# EAGLE design ucmp (EAGLE 9.5.2)
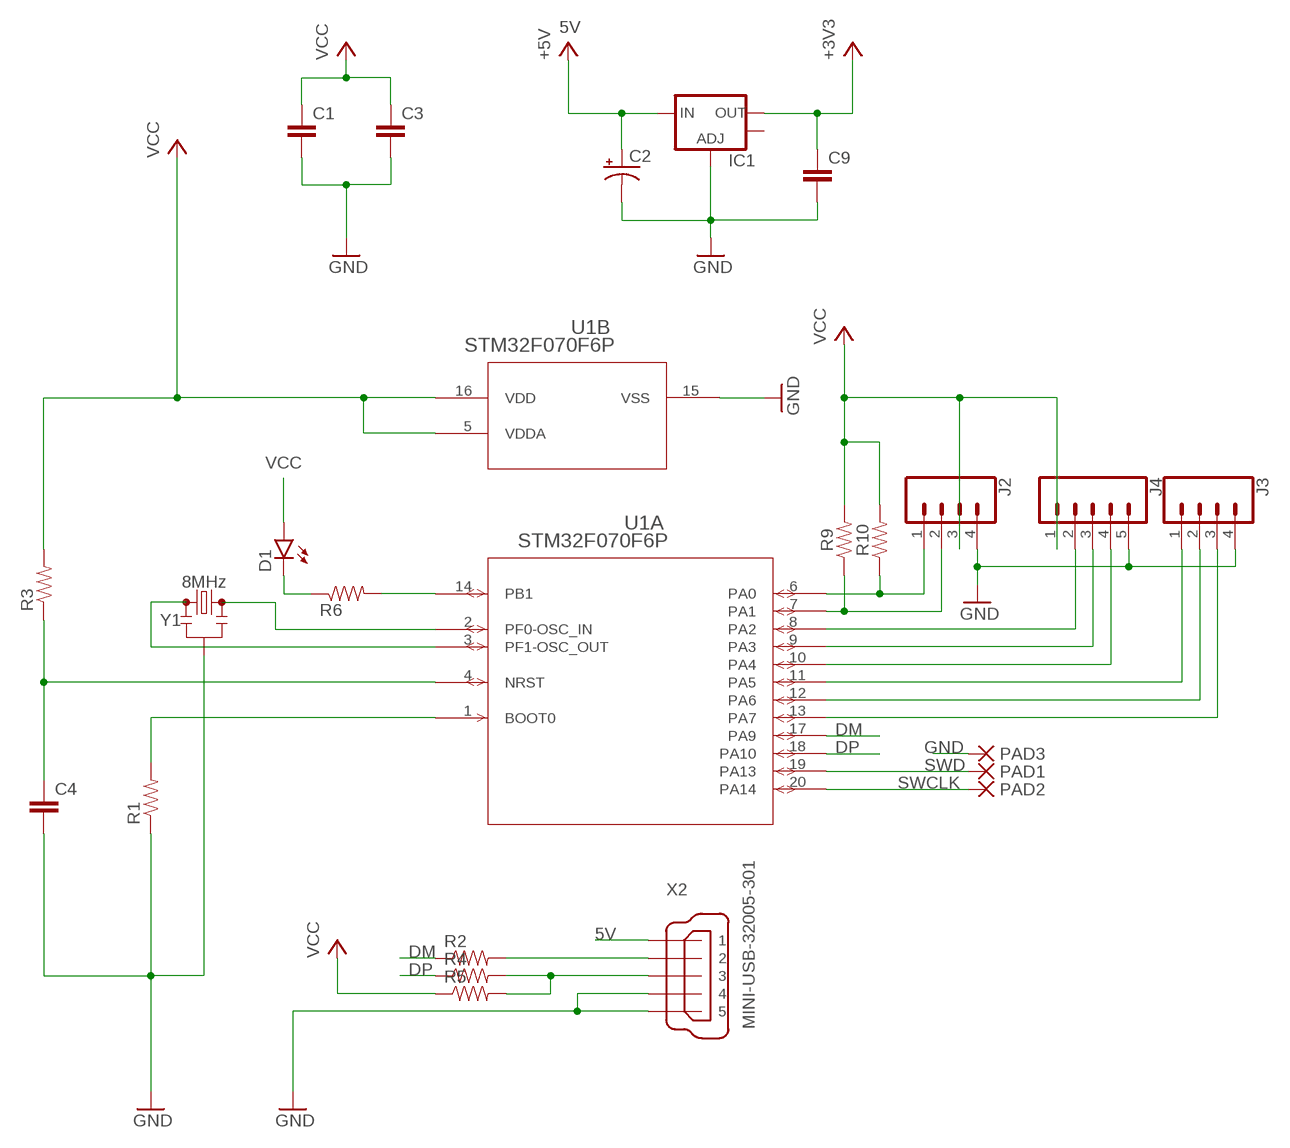
[diagram p0: schematic, sheet 1]

## Parts
C1  CAP0805  [0805]
C2  CAP_POL3528-KIT  [EIA3528-KIT]
C3  CAP0805  [0805]
C4  CAP0805  [0805]
C9  CAP1206  [1206]
D1  LED0603  [LED-0603]
IC1  V_REG_LM1117SOT223  [SOT223]
J2  CONN_041.27MM  [1X04_1.27MM]
J3  CONN_041.27MM  [1X04_1.27MM]
J4  CONN_051.27MM  [1X05_1.27MM]
PAD1  PAD-SMD07R  [SMD07R]
PAD2  PAD-SMD07R  [SMD07R]
PAD3  PAD-SMD07R  [SMD07R]
R1  4.7OHM-1/10W-5%(0603)  [0603-RES]
R2  4.7OHM-1/10W-5%(0603)  [0603-RES]
R3  4.7OHM-1/10W-5%(0603)  [0603-RES]
R4  4.7OHM-1/10W-5%(0603)  [0603-RES]
R5  4.7OHM-1/10W-5%(0603)  [0603-RES]
R6  4.7OHM-1/10W-5%(0603)  [0603-RES]
R9  RESISTOR0805  [0805]
R10  RESISTOR0805  [0805]
U1  STM32F070F6P  [TSSOP20]
X2  MINI-USB-32005-301  [32005-301]
Y1  8MHz  RESONATOR-8MHZSMD_3.2X1.3  [RESONATOR-SMD-3.2X1.3]

## Nets
5V: C2.A(+) IC1.3(IN) X2.1 ; supply symbol labelled +5V
DM: R2.1 U1.17(A:PA9)
DP: R4.1 U1.18(A:PA10)
GND: C1.2 C2.C(-) C3.2 C4.2 C9.2 IC1.1(ADJ) J2.4 J3.4 J4.5 PAD3.PAD(P) R1.1 U1.15(B:VSS) X2.4 X2.5 Y1.2
N$1: R1.2 U1.1(A:BOOT0)
N$2: C4.1 R3.1 U1.4(A:NRST)
N$3: R6.2 U1.14(A:PB1)
N$4: D1.C R6.1
N$5: J2.1 R10.1 U1.6(A:PA0)
N$6: J2.2 R9.1 U1.7(A:PA1)
N$7: J4.2 U1.8(A:PA2)
N$8: J4.3 U1.9(A:PA3)
N$9: J4.4 U1.10(A:PA4)
N$10: R2.2 X2.2
N$11: J3.1 U1.11(A:PA5)
N$12: R4.2 R5.2 X2.3
N$13: J3.2 U1.12(A:PA6)
N$14: J3.3 U1.13(A:PA7)
N$15: U1.2(A:PF0-OSC_IN) Y1.3
N$16: U1.3(A:PF1-OSC_OUT) Y1.1
SWCLK: PAD2.PAD(P) U1.20(A:PA14)
SWD: PAD1.PAD(P) U1.19(A:PA13)
VCC: C1.1 C3.1 C9.1 D1.A IC1.2(OUT) J2.3 J4.1 R3.2 R5.1 R9.2 R10.2 U1.5(B:VDDA) U1.16(B:VDD) ; supply symbol labelled +3V3
Unconnected: IC1.4(OUT)

## Library data of the parts
C1 C3 C4 C9 = SparkFun-Capacitors:CAP: Capacitor Standard 0603 ceramic capacitor, and 0.1" leaded capacitor.
C2 = SparkFun-Passives:CAP_POL: Capacitor Polarized These are standard SMD and PTH capacitors. Normally 10uF, 47uF, and 100uF in electrolytic and tantalum varieties. Always verify the external diameter of the through hole cap, it varies with capacity, voltage, and manufacturer. The EIA devices should be standard.
D1 = SparkFun-LED:LED: LEDs Standard schematic elements and footprints for 5mm, 3mm, 1206, and 0603 sized LEDs. 5mm - Spark Fun Electronics SKU : COM-00529 (and others)
IC1 = SparkFun:V_REG_LM1117: Voltage Regulator LM1117 Standard adjustable voltage regulator but in SMD form. Spark Fun Electronics SKU : COM-00595
J2 J3 = SparkFun-Connectors:CONN_04: Multi connection point. Often used as Generic Header-pin footprint for 0.1 inch spaced/style header connections On any of the 0.1 inch spaced packages, you can populate with these: Break Away Headers - Straight <https://www.sparkfun.com/products/116> (PRT-00116) Break Away Male Headers - Right Angle <https://www.sparkfun.com/products/553> (PRT-00553) Female Headers <https://www.sparkfun.com/products/115> (PRT-00115) Break Away Headers - Machine Pin <https://www.sparkfun.com/products/117> (PRT-00117) Break Away Female Headers - Swiss Machine Pin <https://www.sparkfun.com/products/743> (PRT-00743) For SCREWTERMINALS and SPRING TERMINALS visit here: Screw Terimnals on SparkFun.com <https://www.sparkfun.com/search/results?term=Screw+Terminals> (5mm/3.5mm/2.54mm spacing) This device is also useful as a general connection point to wire up your design to another part of your project. Our various solder wires solder well into these plated through hole pads. Hook-Up Wire - Assortment (Stranded, 22 AWG) <https://www.sparkfun.com/products/11375> (PRT-11375) Hook-Up Wire - Assortment (Solid Core, 22 AWG) <https://www.sparkfun.com/products/11367> (PRT-11367) View the entire wire category on our website here <https://www.sparkfun.com/categories/141> Special notes: Molex polarized connector foot print use with SKU : PRT-08231 with associated crimp pins and housings. 1MM SMD Version SKU: PRT-10208
J4 = SparkFun-Connectors:CONN_05: Multi connection point. Often used as Generic Header-pin footprint for 0.1 inch spaced/style header connections On any of the 0.1 inch spaced packages, you can populate with these: Break Away Headers - Straight <https://www.sparkfun.com/products/116> (PRT-00116) Break Away Male Headers - Right Angle <https://www.sparkfun.com/products/553> (PRT-00553) Female Headers <https://www.sparkfun.com/products/115> (PRT-00115) Break Away Headers - Machine Pin <https://www.sparkfun.com/products/117> (PRT-00117) Break Away Female Headers - Swiss Machine Pin <https://www.sparkfun.com/products/743> (PRT-00743) For SCREWTERMINALS and SPRING TERMINALS visit here: Screw Terimnals on SparkFun.com <https://www.sparkfun.com/search/results?term=Screw+Terminals> (5mm/3.5mm/2.54mm spacing) This device is also useful as a general connection point to wire up your design to another part of your project. Our various solder wires solder well into these plated through hole pads. Hook-Up Wire - Assortment (Stranded, 22 AWG) <https://www.sparkfun.com/products/11375> (PRT-11375) Hook-Up Wire - Assortment (Solid Core, 22 AWG) <https://www.sparkfun.com/products/11367> (PRT-11367) View the entire wire category on our website here <https://www.sparkfun.com/categories/141> Special notes: Molex polarized connector foot print use with SKU : PRT-08231 with associated crimp pins and housings. 1MM SMD Version SKU: PRT-10208
PAD1-PAD3 = dpads:PAD: WIRE PAD Standard US Drill Sizes and SMD pads
R1-R6 = SparkFun-Resistors:4.7OHM-1/10W-5%(0603): RES-08295; PROD_ID: RES-08295
R9 R10 = SparkFun-Resistors:RESISTOR: Generic Resistor Package
U1 = stm32f070f6:STM32F070F6P; COPYRIGHT: Copyright C 2016 Accelerated Designs. All rights reserved; MANUFACTURER_PART_NUMBER: stm32f070f6p; VENDOR: STMicroelectronics
X2 = con-cypressindustries:MINI-USB-: MINI USB-B Conector Source: www.cypressindustries.com; OC_FARNELL: unknown; OC_NEWARK: unknown
Y1 = SparkFun-Clocks:RESONATOR-8MHZ: 8MHz Resonator Digikey Example <http://www.digikey.com/product-detail/en/murata-electronics-north-america/CSTCE10M0G55-R0/490-1196-1-ND/584633> Frequency: 8MHz Frequency Stability: ±0.2% Frequency Tolerance: ±0.5% Capacitance: 33pF SparkFun Products Arduino Pro Mini 328- 3.3V/8MHz <https://www.sparkfun.com/products/11114> SparkFun Digital Sandbox <https://www.sparkfun.com/products/12651>; PROD_ID: XTAL-08895

## Board
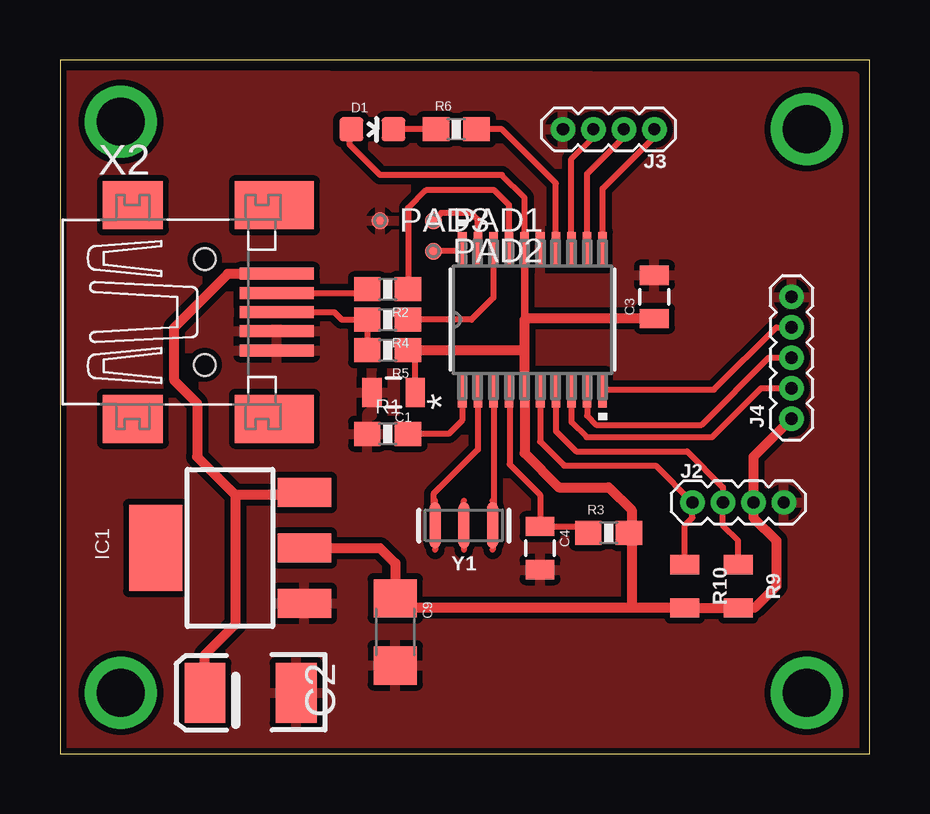
[diagram p1: board, top side]

Size 33.75 x 28.93 mm. Coordinates in mm from the lower left corner, seen from the top.
Outline: 0,0 33.75,0 33.75,28.93 0,28.93 0,0
Copper layers (1*16): Top 0.035mm / dielectric 1.5mm / Bottom 0.035mm
Design rules "SeeedStudio_2layer_DRU_no_angle_20140221 *": minimum track width 6mil, minimum drill 12mil, track to track 10mil, track to pad 10mil, pad to pad 10mil, via to via 8mil, smd to smd 0mil, copper to edge 10mil, drill to drill 10mil, minimum pad ring 10mil, minimum via ring 6mil, stop-mask expansion 2mil, vias tented up to drill 100mil, thermal gap 10mil

### Footprints (pad centres in the part's own frame; a part is rotated, then mirrored left to right if it is on the bottom)
0805 = smd 0.8 x 1.2: 1 -0.9,0; 2 0.9,0
EIA3528-KIT = smd 1.7 x 2.5: A 1.9,0; C -1.9,0
1206 = smd 1.6 x 1.8: 1 -1.4,0; 2 1.4,0
LED-0603 = smd 1 x 1: A 0,-0.877; C 0,0.877
SOT223 = smd 1.219 x 2.235: 1 -2.311,-3.099; 2 0,-3.099; 3 2.311,-3.099 | smd 3.6 x 2.2: 4 0,3.099
1X04_1.27MM = drill 0.508 pad 1: 1 0,0; 2 1.27,0; 3 2.54,0; 4 3.81,0
1X05_1.27MM = drill 0.508 pad 1: 1 0,0; 2 1.27,0; 3 2.54,0; 4 3.81,0; 5 5.08,0
SMD07R = smd 0.7 x 0.7: PAD 0,0
0603-RES = smd 1.1 x 1: 1 -0.85,0; 2 0.85,0
TSSOP20 = smd 1.473 x 0.356: 1 -2.921,2.925; 2 -2.921,2.275; 3 -2.921,1.625; 4 -2.921,0.975; 5 -2.921,0.325; 6 -2.921,-0.325; 7 -2.921,-0.975; 8 -2.921,-1.625; 9 -2.921,-2.275; 10 -2.921,-2.925; 11 2.921,-2.925; 12 2.921,-2.275; 13 2.921,-1.625; 14 2.921,-0.975; 15 2.921,-0.325; 16 2.921,0.325; 17 2.921,0.975; 18 2.921,1.625; 19 2.921,2.275; 20 2.921,2.925
32005-301 = smd 3.1 x 0.5: 1 3,1.6; 2 3,0.8; 3 3,0; 4 3,-0.8; 5 3,-1.6 | smd 2.5 x 2: M1 -3,-4.45; M2 -3,4.45 | smd 3.3 x 2: M3 2.9,4.45; M4 2.9,-4.45 | hole 0.9: 0,2.2; 0,-2.2
RESONATOR-SMD-3.2X1.3 = smd 0.45 x 1.905: 1 -1.2,0; 2 0,0; 3 1.2,0

### Placement (x,y rotation side)
C1  13.9,15.06 180 top
C2  7.94,2.54 180 top
C3  24.77,19.05 90 top
C4  20,8.57 270 top
C9  13.97,5.08 270 top
D1  13.02,26.04 270 top
IC1  7.08,8.58 90 top
J2  26.35,10.48 0 top
J3  24.77,26.04 180 top
J4  30.48,13.97 90 top
PAD1  15.56,22.23 0 top
PAD2  15.56,20.95 0 top
PAD3  13.34,22.23 0 top
R1  13.65,13.34 0 top
R2  13.65,19.37 180 top
R3  22.86,9.21 0 top
R4  13.65,18.1 180 top
R5  13.65,16.83 180 top
R6  16.51,26.04 0 top
R9  28.26,6.99 270 top
R10  26.04,6.99 270 top
U1  19.68,18.1 90 top
X2  6.03,18.41 0 top
Y1  16.83,9.53 180 top

### Tracks (layer width: path | path; a pad name or v marks a point on that pad's centre or on a via)
5V
  Top 0.254: IC1.3 10.09,10.79
  Top 0.305: X2.1 9.02,20 8.71,20
  Top 0.406: 8.71,20 6.99,20 4.76,17.78 4.76,15.56 5.71,14.61 5.71,12.38 7.3,10.79 | C2.A 6.04,4.13 7.3,5.39 7.3,10.79 | 10.09,10.79 7.3,10.79
DM
  Top 0.254: U1.17 18.71,22.88 18.1,23.5 15.24,23.5 14.5,22.76 R2.1
DP
  Top 0.254: U1.18 18.06,19.01 17.14,18.1 R4.1
GND
  pour Top: 0.32,28.29 0.32,0.32 33.11,0.27 33.11,28.24
N$1
  Top 0.254: U1.1 16.76,13.9 16.19,13.34 R1.2
N$2
  Top 0.254: U1.4 18.73,15.15 18.73,12.06 20,10.79 C4.1 21.75,9.47 R3.1
N$3
  Top 0.254: U1.14 20.66,23.79 18.41,26.04 R6.2
N$4
  Top 0.254: R6.1 D1.C
N$5
  Top 0.254: U1.6 20.01,13.01 21,12.02 24.81,12.02 J2.1 26.35,9.84 26.04,9.53 R10.1
N$6
  Top 0.254: U1.7 20.66,13.45 21.5,12.61 26.13,12.61 27.62,11.11 J2.2 27.62,9.53 28.26,8.89 R9.1
N$7
  Top 0.254: U1.8 21.31,13.83 21.94,13.2 27.17,13.2 29.21,15.24 J4.2
N$8
  Top 0.254: U1.9 21.96,14.1 22.34,13.72 26.73,13.72 29.53,16.51 J4.3
N$9
  Top 0.254: U1.10 27.24,15.18 29.84,17.78 J4.4
N$10
  Top 0.254: X2.2 12.65,19.21 R2.2
N$11
  Top 0.254: U1.11 22.61,23.56 24.77,25.72 J3.1
N$12
  Top 0.254: R5.2 R4.2 11.75,18.1 11.43,18.41 X2.3
N$13
  Top 0.254: U1.12 21.96,24.18 23.5,25.72 J3.2
N$14
  Top 0.254: U1.13 21.31,24.8 22.23,25.72 J3.3
N$15
  Top 0.254: U1.2 17.41,12.68 15.56,10.82 15.56,9.6 Y1.3
N$16
  Top 0.254: U1.3 18.07,15.17 18.07,9.57 Y1.1
N$17  (via drill 2)
  other vias: 2.54,26.35
N$18  (via drill 2)
  other vias: 31.11,26.04
N$19  (via drill 2)
  other vias: 31.11,2.54
N$20  (via drill 2)
  other vias: 2.54,2.54
SWCLK
  Top 0.254: PAD2.PAD 16.7,20.95 U1.20
SWD
  Top 0.254: U1.19 17.41,22.28 17.14,22.54 15.88,22.54 PAD1.PAD
VCC
  Top 0.254: 30.16,13.65 J4.1 | 28.89,10.16 J2.3 | U1.16 19.36,23.18 18.41,24.13 13.34,24.13 12.06,25.4 12.06,25.96 D1.A | U1.16 | 19.41,18.15 19.36,18.1 | C1.1 14.8,16.53 R5.1 | C9.1 13.97,6.67 14.55,6.08 | 23.81,9.31 R3.2 23.81,9.11
  Top 0.305: 19.36,18.1 U1.16
  Top 0.406: J4.1 28.89,12.38 J2.3 28.89,9.84 29.84,8.89 29.84,6.99 28.95,6.08 R9.2 R10.2 23.81,6.08 | 19.36,16.83 U1.5 19.36,12.53 20.78,11.11 22.86,11.11 23.81,10.16 23.81,9.31 | 19.36,16.83 19.36,18.1 | C3.1 19.41,18.15 | R5.1 19.36,16.83 | IC1.2 13.32,8.58 13.97,7.94 13.97,6.67 | 23.81,6.08 14.55,6.08 | 23.81,9.11 23.81,6.08